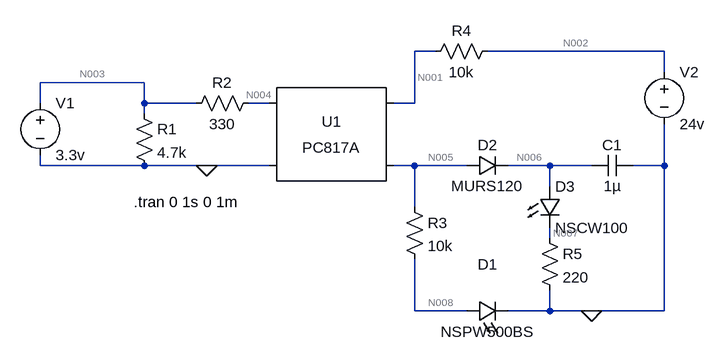
[diagram p0: schematic Prob 3_After.asc]
Prob 3_After.asc, the LTspice schematic file:
Version 4
SHEET 1 1112 680
WIRE 352 32 320 32
WIRE 704 32 432 32
WIRE 704 64 704 32
WIRE -96 80 -256 80
WIRE -256 112 -256 80
WIRE -96 112 -96 80
WIRE -16 112 -96 112
WIRE 96 112 64 112
WIRE 320 112 320 32
WIRE 320 112 288 112
WIRE -96 128 -96 112
WIRE -256 208 -256 192
WIRE -96 208 -256 208
WIRE 0 208 -96 208
WIRE 96 208 0 208
WIRE 320 208 288 208
WIRE 400 208 320 208
WIRE 528 208 464 208
WIRE 592 208 528 208
WIRE 704 208 704 144
WIRE 704 208 656 208
WIRE 528 240 528 208
WIRE 320 272 320 208
WIRE 528 320 528 304
WIRE 320 432 320 352
WIRE 400 432 320 432
WIRE 528 432 528 400
WIRE 528 432 464 432
WIRE 592 432 528 432
WIRE 704 432 704 208
WIRE 704 432 592 432
FLAG 0 208 0
FLAG 592 432 0
SYMBOL Optos\\PC817A 192 160 R0
SYMATTR InstName U1
SYMBOL res -112 112 R0
SYMATTR InstName R1
SYMATTR Value 4.7k
SYMBOL res -32 128 R270
WINDOW 0 32 56 VTop 2
WINDOW 3 0 56 VBottom 2
SYMATTR InstName R2
SYMATTR Value 330
SYMBOL voltage -256 96 R0
WINDOW 123 0 0 Left 0
WINDOW 39 0 0 Left 0
SYMATTR InstName V1
SYMATTR Value 3.3v
SYMBOL voltage 704 48 R0
WINDOW 123 0 0 Left 0
WINDOW 39 0 0 Left 0
SYMATTR InstName V2
SYMATTR Value 24v
SYMBOL res 304 256 R0
SYMATTR InstName R3
SYMATTR Value 10k
SYMBOL LED 400 448 R270
WINDOW 0 72 32 VTop 2
WINDOW 3 0 32 VBottom 2
SYMATTR InstName D1
SYMATTR Value NSPW500BS
SYMBOL diode 400 224 R270
WINDOW 0 32 32 VTop 2
WINDOW 3 0 32 VBottom 2
SYMATTR InstName D2
SYMATTR Value MURS120
SYMBOL cap 656 192 R90
WINDOW 0 0 32 VBottom 2
WINDOW 3 32 32 VTop 2
SYMATTR InstName C1
SYMATTR Value 1µ
SYMATTR SpiceLine V=16v
SYMBOL res 448 16 R90
WINDOW 0 0 56 VBottom 2
WINDOW 3 32 56 VTop 2
SYMATTR InstName R4
SYMATTR Value 10k
SYMBOL LED 512 240 R0
SYMATTR InstName D3
SYMATTR Value NSCW100
SYMATTR Description Diode
SYMATTR Type diode
SYMBOL res 512 304 R0
SYMATTR InstName R5
SYMATTR Value 220
TEXT -112 264 Left 2 !.tran 0 1s 0 1m

The netlist it stands for:
* Prob 3_After.asc
XU1 N004 0 N001 N005 PC817 Igain=1m
R1 N003 0 4.7k
R2 N003 N004 330
V1 N003 0 3.3v
V2 N002 0 24v
R3 N005 N008 10k
D1 N008 0 NSPW500BS
D2 N005 N006 MURS120
C1 0 N006 1µ V=16v
R4 N002 N001 10k
D3 N006 N007 NSCW100
R5 N007 0 220
.model D D
.lib standard.dio
.tran 0 1s 0 1m
.lib PC817.sub
.backanno
.end

* Results of the author's LTspice run, read from the files saved beside the schematic
* Operating Point, zero values left out:
*   V(n004) = 1.075 V
*   V(n001) = 3.94 V
*   V(n005) = 3.799 V
*   V(n003) = 3.3 V
*   V(n002) = 24 V
*   V(n008) = 2.321 V
*   V(n006) = 3.314 V
*   V(n007) = 408.8 mV
*   I(D3) = 1.858 mA
*   I(D2) = 1.858 mA
*   I(D1) = 147.8 µA
*   I(R5) = 1.858 mA
*   I(R4) = 2.006 mA
*   I(R3) = 147.8 µA
*   I(R2) = 6.742 mA
*   I(R1) = 702.1 µA
*   I(V2) = -2.006 mA
*   I(V1) = -7.444 mA
*   Ix(u1:1) = 6.742 mA
*   Ix(u1:2) = -6.742 mA
*   Ix(u1:3) = 2.006 mA
*   Ix(u1:4) = -2.006 mA